# EAGLE board 17341^0 (EAGLE 7.6.0), part 1 of 2
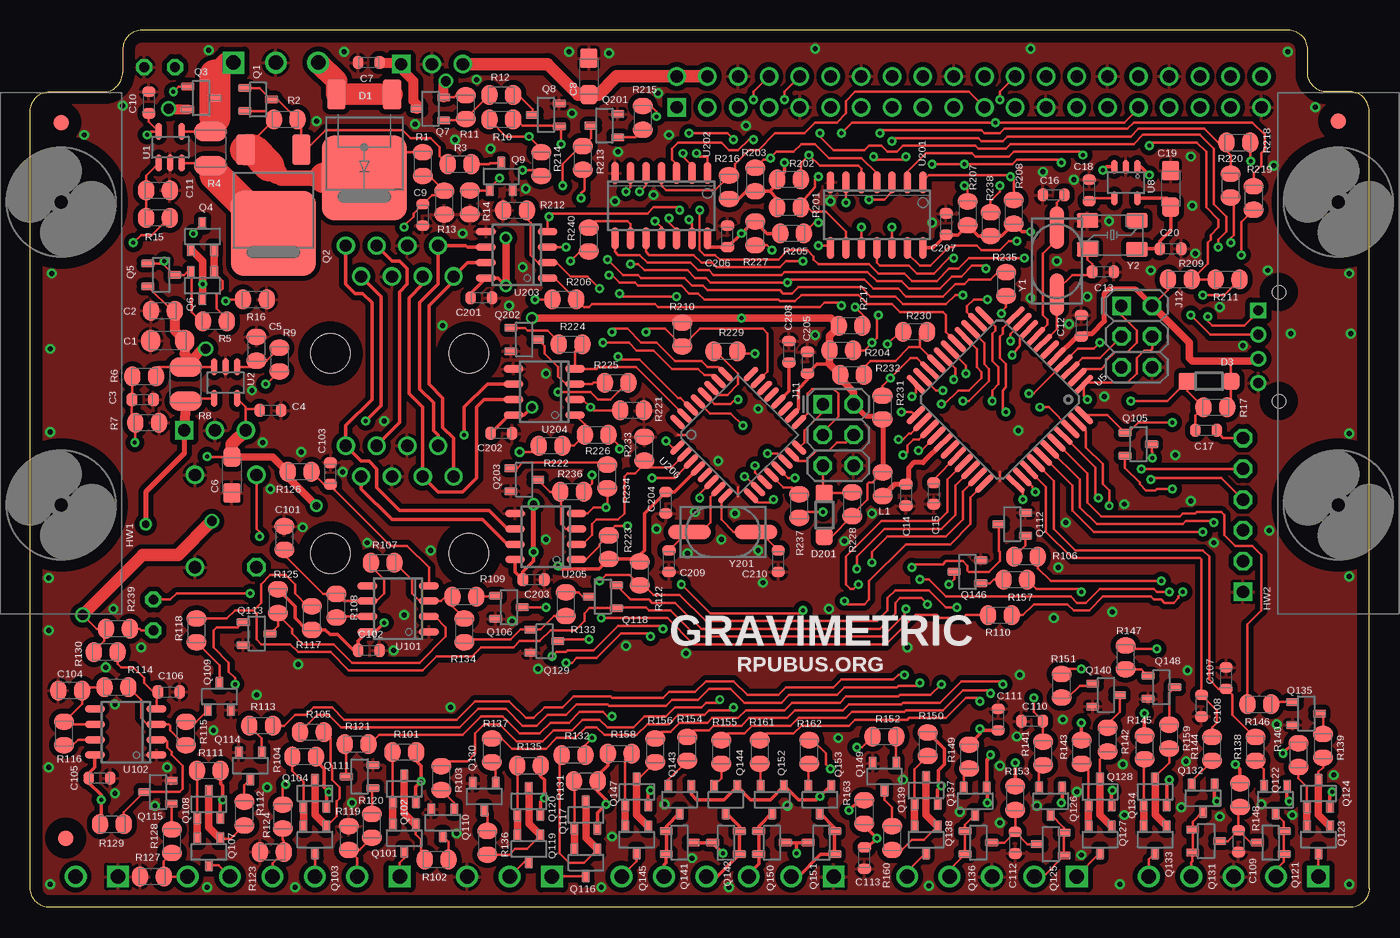
[diagram p3: board, top side]
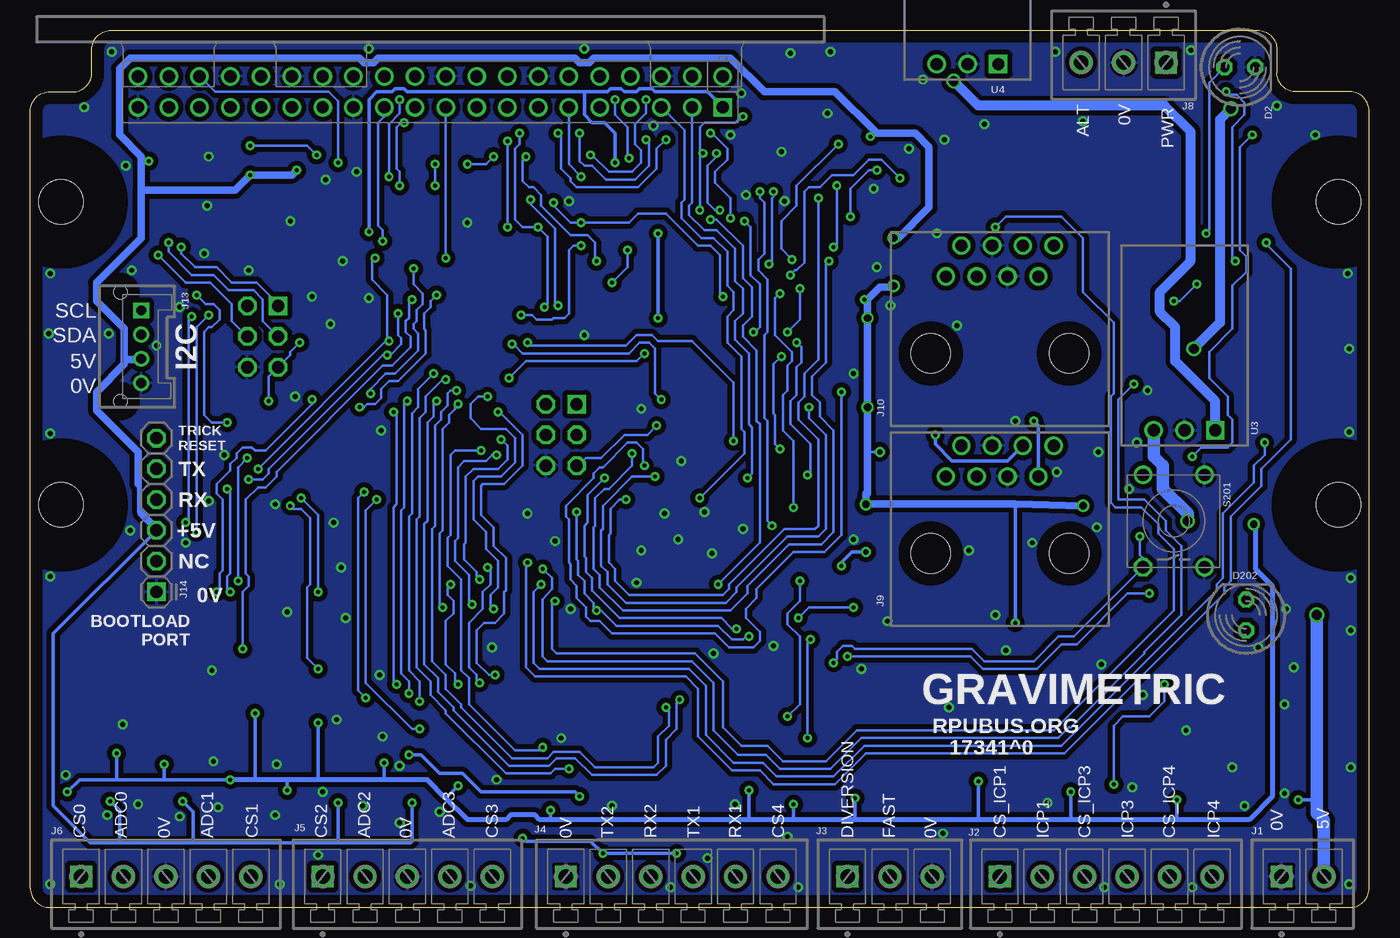
[diagram p4: board, bottom side, seen from below]

Size 110.49 x 72.39 mm. Coordinates in mm from the lower left corner, seen from the top.
Outline: 110.49,1.59 110.49,65.72 arc90 108.9,67.31 107,67.31 arc-90 105.41,68.9 105.41,70.8 arc90 103.82,72.39 9.21,72.39 arc90 7.62,70.8 7.62,68.9 arc-90 6.03,67.31 1.59,67.31 arc90 0,65.72 0,1.59 arc90 1.59,0 108.9,0 arc90 110.49,1.59
Copper layers (1*16): Top 0.034290625mm / dielectric 60mil / Bottom 0.034290625mm
Design rules "default *": minimum track width 7mil, minimum drill 13mil, track to track 12mil, track to pad 10mil, pad to pad 8mil, via to via 12mil, smd to smd 8mil, copper to edge 40mil, drill to drill 16mil, minimum pad ring 10mil, minimum via ring 8mil, stop-mask expansion 4mil, vias tented up to drill 17mil, thermal gap 10mil
Net classes: 0 default: width 0.178 mm, drill 0.33 mm

## Footprints (pad centres in the part's own frame; a part is rotated, then mirrored left to right if it is on the bottom)
C1206(3216) = smd 1.6 x 1.8: 1 -1.4,0; 2 1.4,0
C0805(2012) = smd 1.321 x 1.651: 1 -0.977,0; 2 0.977,0
C0603(1608) = smd 0.898 x 1.1: 1 -0.889,0; 2 0.889,0
3216 = smd 1.6 x 1.4: + -1.5,0; - 1.5,0
DPAK_A+A-K = smd 1.5 x 2.5: A1 -2.3,-6.9; A2 2.3,-6.9 | smd 7 x 7: K 0,0
LED5MM = drill 0.813 octagon: A -1.27,0; K 1.27,0
SOD123 = smd 1.4 x 1.4: A 1.8,0; C -1.8,0
USA10 = hole 3.658: -12.5,0; 12.5,0
MCV2 = drill 1.2 square: 1 0,0 | drill 1.2: 2 3.5,0
MCV6 = drill 1.2 square: 1 0,0 | drill 1.2: 2 3.5,0; 3 7,0; 4 10.5,0; 5 14,0; 6 17.5,0
MCV3 = drill 1.2 square: 1 0,0 | drill 1.2: 2 3.5,0; 3 7,0
MCV5 = drill 1.2 square: 1 0,0 | drill 1.2: 2 3.5,0; 3 7,0; 4 10.5,0; 5 14,0
RASPI_ZERO_V40PIN = drill 1.016 square: 1 0,2.54 | drill 1.016: 2 0,0; 3 2.54,2.54; 4 2.54,0; 5 5.08,2.54; 6 5.08,0; 7 7.62,2.54; 8 7.62,0; 9 10.16,2.54; 10 10.16,0; 11 12.7,2.54; 12 12.7,0; 13 15.24,2.54; 14 15.24,0; 15 17.78,2.54; 16 17.78,0; 17 20.32,2.54; 18 20.32,0; 19 22.86,2.54; 20 22.86,0; 21 25.4,2.54; 22 25.4,0; 23 27.94,2.54; 24 27.94,0; 25 30.48,2.54; 26 30.48,0; 27 33.02,2.54; 28 33.02,0; 29 35.56,2.54; 30 35.56,0; 31 38.1,2.54; 32 38.1,0; 33 40.64,2.54; 34 40.64,0; 35 43.18,2.54; 36 43.18,0; 37 45.72,2.54; 38 45.72,0; 39 48.26,2.54; 40 48.26,0
RJ45-8HZT = drill 1: 1 -4.445,6.35; 2 -3.175,8.89; 3 -1.905,6.35; 4 -0.635,8.89; 5 0.635,6.35; 6 1.905,8.89; 7 3.175,6.35; 8 4.445,8.89 | hole 3.264: -5.715,0; 5.715,0
ISP = drill 1.016 square: 1 0,0 | drill 1.016 octagon: 2 0,2.54; 3 2.54,0; 4 2.54,2.54; 5 5.08,0; 6 5.08,2.54
B04B = drill 0.8 square: 1 0,0 | drill 0.8: 2 2,0; 3 4,0; 4 6,0 | hole 1.1: 7.5,-1.7; -1.5,-1.7
FRIEND = drill 1.016 square: 1 0,0 | drill 1.016 octagon: 2 2.54,0; 3 5.08,0; 4 7.62,0; 5 10.16,0; 6 12.7,0
SOT23 = smd 0.65 x 1.06: B -0.95,-1.1; C 0,1.1; E 0.95,-1.1
DPAK = smd 1.5 x 2.5: 1 -2.3,-6.9; 3 2.3,-6.9 | smd 7 x 7: SINK 0,0
SOT23' = smd 0.65 x 1.06: 1(G) -0.95,-1.1; 2(S) 0.95,-1.1; 3(D) 0,1.1
C1210(3225) = smd 1.6 x 2.7: 1 -1.4,0; 2 1.4,0
0M311 = drill 1.016 octagon: 1 -3.81,2.54 | drill 1.016: 2 3.81,2.54; 3 -3.81,-2.54; 4 3.81,-2.54
SOT23-5 = smd 0.55 x 1.4: 1 -0.95,-1.3; 2 0,-1.3; 3 0.95,-1.3; 4 0.95,1.3; 5 -0.95,1.3
OKI-78SR-H = drill 1.016 square: 1 0,0 | drill 1.016: 2 -2.54,0; 3 -5.08,0
TQFP44 = smd 2 x 0.45: 1 -5.8,4; 2 -5.8,3.2; 3 -5.8,2.4; 4 -5.8,1.6; 5 -5.8,0.8; 6 -5.8,0; 7 -5.8,-0.8; 8 -5.8,-1.6; 9 -5.8,-2.4; 10 -5.8,-3.2; 11 -5.8,-4; 23 5.8,-4; 24 5.8,-3.2; 25 5.8,-2.4; 26 5.8,-1.6; 27 5.8,-0.8; 28 5.8,0; 29 5.8,0.8; 30 5.8,1.6; 31 5.8,2.4; 32 5.8,3.2; 33 5.8,4 | smd 0.45 x 2: 12 -4,-5.8; 13 -3.2,-5.8; 14 -2.4,-5.8; 15 -1.6,-5.8; 16 -0.8,-5.8; 17 0,-5.8; 18 0.8,-5.8; 19 1.6,-5.8; 20 2.4,-5.8; 21 3.2,-5.8; 22 4,-5.8; 34 4,5.8; 35 3.2,5.8; 36 2.4,5.8; 37 1.6,5.8; 38 0.8,5.8; 39 0,5.8; 40 -0.8,5.8; 41 -1.6,5.8; 42 -2.4,5.8; 43 -3.2,5.8; 44 -4,5.8
SOT23-5,SOT25 = smd 0.55 x 1.2: 1 -0.95,-1.3; 2 0,-1.3; 3 0.95,-1.3; 4 0.95,1.3; 5 -0.95,1.3
SOIC8 = smd 0.6 x 1.6: 1 -1.905,-2.54; 2 -0.635,-2.54; 3 0.635,-2.54; 4 1.905,-2.54; 5 1.905,2.54; 6 0.635,2.54; 7 -0.635,2.54; 8 -1.905,2.54
14SOIC = smd 0.6 x 1.8: 1 -3.81,-2.7; 2 -2.54,-2.7; 3 -1.27,-2.7; 4 0,-2.7; 5 1.27,-2.7; 6 2.54,-2.7; 7 3.81,-2.7; 8 3.81,2.7; 9 2.54,2.7; 10 1.27,2.7; 11 0,2.7; 12 -1.27,2.7; 13 -2.54,2.7; 14 -3.81,2.7
TQFP32-08 = smd 1.5 x 0.45: 1 -4.293,2.8; 2 -4.293,2; 3 -4.293,1.2; 4 -4.293,0.4; 5 -4.293,-0.4; 6 -4.293,-1.2; 7 -4.293,-2; 8 -4.293,-2.8; 17 4.293,-2.8; 18 4.293,-2; 19 4.293,-1.2; 20 4.293,-0.4; 21 4.293,0.4; 22 4.293,1.2; 23 4.293,2; 24 4.293,2.8 | smd 0.45 x 1.5: 9 -2.8,-4.293; 10 -2,-4.293; 11 -1.2,-4.293; 12 -0.4,-4.293; 13 0.4,-4.293; 14 1.2,-4.293; 15 2,-4.293; 16 2.8,-4.293; 25 2.8,4.293; 26 2,4.293; 27 1.2,4.293; 28 0.4,4.293; 29 -0.4,4.293; 30 -1.2,4.293; 31 -2,4.293; 32 -2.8,4.293
FIDUCIAL-1.27 = smd 1.27 x 1.27: 1 0,0
CSM-3X = smd 3.5 x 1.2: 1 -2.75,0; 2 2.75,0
CRYSTAL5X3.2MM = smd 1.778 x 1.194: 1 -2.032,-1.194; 2 2.032,-1.194; 3 2.032,1.194; 4 -2.032,1.194

## Placement (x,y rotation side)
C1  10uF  [C1206(3216)]  11.34,46.77 180 top
C2  .1uF  [C0805(2012)]  10.94,49.25 180 top
C3  .01uF  [C0603(1608)]  9.27,41.91 0 top
C4  .1uF  [C0603(1608)]  19.81,41.02 0 top
C5  1uF  [C0805(2012)]  18.67,46.1 90 top
C6  106A  [3216]  16.64,35.69 270 top
C7  .1uF  [C0603(1608)]  27.94,69.72 180 top
C8  10uF  [3216]  46.1,68.58 90 top
C9  .01uF  [C0603(1608)]  32.38,57.15 270 top
C10  .1uF  [C0603(1608)]  9.78,66.42 90 top
C11  1uF  [C0805(2012)]  10.54,59.18 0 top
C12  .1uF  [C0603(1608)]  86.74,48.01 90 top
C13  27pF  [C0603(1608)]  88.52,52.45 180 top
C14  .1uF  [C0603(1608)]  72.26,34.04 270 top
C15  .1uF  [C0603(1608)]  74.55,34.16 270 top
C16  27pF  [C0603(1608)]  84.45,58.8 0 top
C17  .1uF  [C0603(1608)]  97.03,39.37 0 top
C18  470pF  [C0603(1608)]  87.38,59.18 90 top
C19  10uF  [3216]  94.11,59.31 90 top
C20  .1uF  [C0603(1608)]  94.11,54.36 0 top
C101  .01uF  [C0805(2012)]  20.96,30.48 90 top
C102  100nF  [C0603(1608)]  27.94,21.21 0 top
C103  100nF  [C0603(1608)]  24.77,35.81 90 top
C104  0.01uF  [C0805(2012)]  3.3,17.91 180 top
C105  100nF  [C0603(1608)]  5.71,10.67 0 top
C106  100nF  [C0603(1608)]  11.43,17.78 0 top
C107  .01uF  [C0603(1608)]  98.68,18.92 90 top
C108  .01uF  [C0603(1608)]  96.65,16.64 270 top
C109  .1uF  [C0603(1608)]  99.7,5.46 270 top
C110  .01uF  [C0603(1608)]  82.68,15.37 180 top
C111  .01uF  [C0603(1608)]  79.88,15.49 90 top
C112  .1uF  [C0603(1608)]  81.28,5.33 270 top
C113  .1uF  [C0603(1608)]  68.83,4.06 270 top
C201  .1uF  [C0603(1608)]  37.21,50.29 0 top
C202  .1uF  [C0603(1608)]  38.86,39.12 0 top
C203  .1uF  [C0603(1608)]  41.53,27.05 0 top
C204  .1uF  [C0603(1608)]  52.45,33.4 270 top
C205  .1uF  [C0603(1608)]  64.14,44.96 90 top
C206  .1uF  [C0603(1608)]  57.53,55.37 90 top
C207  .1uF  [C0603(1608)]  75.56,56.39 90 top
C208  .1uF  [C0603(1608)]  62.61,45.85 90 top
C209  27pF  [C0603(1608)]  52.7,28.57 270 top
C210  27pF  [C0603(1608)]  61.72,28.57 270 top
D1  MBRD1045  [DPAK_A+A-K]  27.56,60.2 180 top
D2  5MMGN  [LED5MM]  10.67,69.34 0 bottom
D3  T4  [SOD123]  97.28,43.43 180 top
D201  T4  [SOD123]  65.53,32.38 90 top
D202  5MMRD  [LED5MM]  10.16,24.13 90 bottom
HW1  USA10-4,6  [USA10]  2.54,45.72 90 top
HW2  USA10-4,6  [USA10]  107.95,45.72 90 top
J1  PST1,0/2-3,5  [MCV2]  7.24,2.54 0 bottom
J2  PST1,0/6-3,5  [MCV6]  30.48,2.54 0 bottom
J3  PST1,0/3-3,5  [MCV3]  43.05,2.54 0 bottom
J4  [MCV6]  66.29,2.54 0 bottom
J5  PST1,0/5-3,5  [MCV5]  86.36,2.54 0 bottom
J6  PST1,0/5-3,5  [MCV5]  106.3,2.54 0 bottom
J7  Pi Zero  [RASPI_ZERO_V40PIN]  53.34,68.58 180 bottom
J8  PST1,0/3-3,5  [MCV3]  16.76,69.72 180 bottom
J9  RJ45J  [RJ45-8HZT]  30.48,29.21 0 bottom
J10  RJ45J  [RJ45-8HZT]  30.48,45.72 0 bottom
J11  [ISP]  65.41,41.53 270 top
J12  ICSP  [ISP]  90.04,49.66 270 top
J13  S04B  [B04B]  101.35,49.28 270 bottom
J14  FRIEND  [FRIEND]  100.08,26.04 90 bottom
L1  JMP  [C0805(2012)]  70.36,34.92 270 top
Q1  K1N  [SOT23]  18.8,66.67 270 top
Q2  IRFR5305  [DPAK]  20.07,55.63 180 top
Q3  P65  [SOT23']  14.1,66.8 270 top
Q4  K3N  [SOT23]  14.22,55.37 0 top
Q5  K1N  [SOT23]  10.79,52.2 270 top
Q6  K3N  [SOT23]  14.22,51.31 180 top
Q7  P65  [SOT23']  33.02,65.91 90 top
Q8  K38  [SOT23']  42.54,65.41 90 top
Q9  K38  [SOT23']  38.86,60.33 0 top
Q101  K3N  [SOT23]  30.86,5.71 180 top
Q102  K3N  [SOT23]  30.86,9.78 0 top
Q103  K3N  [SOT23]  23.5,5.59 180 top
Q104  K3N  [SOT23]  23.5,9.4 0 top
Q105  K38  [SOT23']  91.44,38.23 270 top
Q106  K1N  [SOT23]  39.5,24.77 270 top
Q107  K3N  [SOT23]  14.73,4.57 180 top
Q108  K3N  [SOT23]  14.73,8.51 0 top
Q109  K1N  [SOT23]  15.62,17.4 0 top
Q110  K1N  [SOT23]  34.04,6.99 180 top
Q111  K1N  [SOT23]  27.18,10.79 90 top
Q112  K1N  [SOT23]  81.03,31.62 90 top
Q113  K1N  [SOT23]  18.67,22.61 270 top
Q114  K1N  [SOT23]  18.16,11.68 180 top
Q115  K1N  [SOT23]  10.54,9.53 90 top
Q116  K3N  [SOT23]  45.85,3.68 180 top
Q117  K3N  [SOT23]  45.85,7.62 0 top
Q118  K38  [SOT23']  47.24,25.65 90 top
Q119  K3N  [SOT23]  41.15,4.83 180 top
Q120  K3N  [SOT23]  41.15,8.76 0 top
Q121  K1N  [SOT23]  102.36,5.33 90 top
Q122  K38  [SOT23']  102.74,8.89 180 top
Q123  K3N  [SOT23]  106.3,5.59 180 top
Q124  K3N  [SOT23]  106.3,9.4 0 top
Q125  K1N  [SOT23]  84.2,5.21 90 top
Q126  K38  [SOT23']  84.2,8.76 180 top
Q127  K3N  [SOT23]  88.27,5.59 180 top
Q128  K3N  [SOT23]  88.27,9.53 0 top
Q129  K1N  [SOT23]  42.42,21.97 270 top
Q130  K1N  [SOT23]  37.46,9.14 180 top
Q131  K1N  [SOT23]  97.03,5.46 270 top
Q132  K38  [SOT23']  96.77,9.02 180 top
Q133  K3N  [SOT23]  92.84,5.59 180 top
Q134  K3N  [SOT23]  92.84,9.53 0 top
Q135  K1N  [SOT23]  105.28,16 270 top
Q136  K1N  [SOT23]  78.23,5.33 270 top
Q137  K38  [SOT23']  77.98,8.76 180 top
Q138  K3N  [SOT23]  73.91,5.59 180 top
Q139  K3N  [SOT23]  73.91,9.65 0 top
Q140  K1N  [SOT23]  88.77,17.53 270 top
Q141  K1N  [SOT23]  53.59,5.33 270 top
Q142  K1N  [SOT23]  57.4,5.33 90 top
Q143  K38  [SOT23']  53.59,8.89 180 top
Q144  K38  [SOT23']  57.4,8.89 180 top
Q145  K3N  [SOT23]  50.04,5.59 180 top
Q146  K1N  [SOT23]  77.34,27.69 90 top
Q147  K3N  [SOT23]  50.04,9.53 0 top
Q148  K1N  [SOT23]  93.34,18.16 270 top
Q149  K1N  [SOT23]  70.48,10.79 180 top
Q150  K1N  [SOT23]  61.21,5.33 270 top
Q151  K1N  [SOT23]  65.28,5.33 90 top
Q152  K38  [SOT23']  61.21,8.89 180 top
Q153  K38  [SOT23']  65.15,8.89 180 top
Q201  K1N  [SOT23]  47.37,64.52 90 top
Q202  K1N  [SOT23]  40.77,46.86 270 top
Q203  K1N  [SOT23]  40.77,35.31 270 top
R1  100k  [C0805(2012)]  32.38,61.34 90 top
R2  100k  [C0805(2012)]  21.08,65.02 180 top
R3  49.9k  [C0805(2012)]  35.43,61.34 180 top
R4  0.018  [C1210(3225)]  14.86,62.61 270 top
R5  1K  [C0805(2012)]  15.24,48.39 180 top
R6  100k  [C0805(2012)]  9.4,43.81 0 top
R7  15.8k  [C0805(2012)]  9.65,40.01 180 top
R8  0.068  [C1210(3225)]  12.83,43.18 90 top
R9  10k  [C0805(2012)]  20.57,45.21 90 top
R10  10k  [C0805(2012)]  38.86,65.02 180 top
R11  100k  [C0805(2012)]  35.94,66.04 270 top
R12  80.6k  [C0805(2012)]  38.86,67.06 0 top
R13  10k  [C0805(2012)]  34.16,58.17 90 top
R14  10k  [C0805(2012)]  36.28,58.18 270 top
R15  10k  [C0805(2012)]  10.54,56.9 180 top
R16  100k  [C0805(2012)]  18.54,50.16 180 top
R17  10K  [C0805(2012)]  97.79,41.27 0 top
R101  32.4  [C0805(2012)]  30.86,12.83 0 top
R102  49.9k  [C0805(2012)]  33.53,3.94 180 top
R103  10k  [C0805(2012)]  33.91,10.67 270 top
R104  32.4  [C0805(2012)]  22.61,12.45 0 top
R105  49.9k  [C0805(2012)]  23.24,14.48 0 top
R106  10k  [C0805(2012)]  82.17,28.96 180 top
R107  100k  [C0805(2012)]  29.08,28.45 0 top
R108  182  [C0805(2012)]  25.27,24.89 270 top
R109  10k  [C0805(2012)]  35.81,25.65 0 top
R110  182  [C0805(2012)]  80.01,24.13 180 top
R111  32.4  [C0805(2012)]  14.73,11.3 0 top
R112  49.9k  [C0805(2012)]  17.65,7.75 270 top
R113  10k  [C0805(2012)]  19.05,14.99 180 top
R114  100k  [C0805(2012)]  7.11,18.16 0 top
R115  10k  [C0805(2012)]  12.83,14.35 90 top
R116  182  [C0805(2012)]  2.79,14.35 270 top
R117  10k  [C0805(2012)]  23.24,23.88 90 top
R118  182  [C0805(2012)]  13.72,22.86 90 top
R119  100  [C0805(2012)]  26.29,5.71 270 top
R120  10k  [C0805(2012)]  28.19,6.73 90 top
R121  182  [C0805(2012)]  26.92,13.46 0 top
R122  10k  [C0805(2012)]  50.29,27.56 270 top
R123  100  [C0805(2012)]  19.94,4.57 0 top
R124  10k  [C0805(2012)]  20.83,7.49 90 top
R125  10k  [C0805(2012)]  20.45,25.27 270 top
R126  100k  [C0805(2012)]  22.23,35.94 180 top
R127  100  [C0805(2012)]  10.03,2.54 0 top
R128  10k  [C0805(2012)]  11.68,5.46 90 top
R129  10k  [C0805(2012)]  6.73,6.86 0 top
R130  100k  [C0805(2012)]  6.22,21.08 180 top
R131  27  [C0805(2012)]  45.85,10.41 0 top
R132  49.9k  [C0805(2012)]  44.83,12.57 180 top
R133  10k  [C0805(2012)]  44.2,25.02 270 top
R134  10k  [C0805(2012)]  35.81,22.86 270 top
R135  27  [C0805(2012)]  41.15,11.68 0 top
R136  49.9k  [C0805(2012)]  37.72,5.33 270 top
R137  10k  [C0805(2012)]  38.1,12.95 270 top
R138  127  [C0805(2012)]  101.09,13.08 90 top
R139  49.9k  [C0805(2012)]  106.68,13.34 270 top
R140  27  [C0805(2012)]  104.65,12.57 90 top
R141  127  [C0805(2012)]  83.57,12.7 90 top
R142  49.9k  [C0805(2012)]  88.9,13.84 270 top
R143  27  [C0805(2012)]  86.74,12.83 90 top
R144  127  [C0805(2012)]  97.54,13.08 90 top
R145  27  [C0805(2012)]  91.95,13.21 90 top
R146  10k  [C0805(2012)]  101.41,16.76 180 top
R147  10k  [C0805(2012)]  90.39,20.63 90 top
R148  100K  [C0805(2012)]  99.82,9.27 270 top
R149  127  [C0805(2012)]  77.47,12.45 90 top
R150  27  [C0805(2012)]  74.04,13.46 90 top
R151  10k  [C0805(2012)]  85.09,18.29 90 top
R152  10k  [C0805(2012)]  70.48,14.1 180 top
R153  100K  [C0805(2012)]  81.28,9.02 270 top
R154  127  [C0805(2012)]  54.23,13.08 90 top
R155  127  [C0805(2012)]  57.02,12.83 90 top
R156  49.9k  [C0805(2012)]  51.56,12.95 270 top
R157  10k  [C0805(2012)]  81.28,27.05 0 top
R158  27  [C0805(2012)]  48.64,12.7 180 top
R159  49.9k  [C0805(2012)]  93.98,14.1 270 top
R160  49.9k  [C0805(2012)]  71.12,5.71 270 top
R161  127  [C0805(2012)]  60.2,12.83 90 top
R162  127  [C0805(2012)]  64.26,12.83 90 top
R163  100K  [C0805(2012)]  68.83,7.87 270 top
R201  10k  [C0805(2012)]  62.61,57.78 0 top
R202  10k  [C0805(2012)]  62.61,60.07 0 top
R203  1.82k  [C0805(2012)]  59.82,60.07 270 top
R204  3.01k  [C0805(2012)]  66.93,45.97 180 top
R205  3.01k  [C0805(2012)]  62.87,55.63 180 top
R206  10k  [C0805(2012)]  44.07,50.16 180 top
R207  10k  [C0805(2012)]  77.34,57.28 270 top
R208  10k  [C0805(2012)]  81.15,57.4 270 top
R209  3.01k  [C0805(2012)]  94.87,51.82 0 top
R210  10k  [C0805(2012)]  53.81,47.28 90 top
R211  182  [C0805(2012)]  98.81,51.82 180 top
R212  3.01k  [C0805(2012)]  40,57.53 0 top
R213  3.01k  [C0805(2012)]  45.59,61.85 270 top
R214  10K  [C0805(2012)]  42.16,61.34 270 top
R215  100k  [C0805(2012)]  50.55,65.15 90 top
R216  1.82k  [C0805(2012)]  57.66,59.44 90 top
R217  3.01k  [C0805(2012)]  67.69,48.01 0 top
R218  3.01k  [C0805(2012)]  99.7,63.12 180 top
R219  182  [C0805(2012)]  100.97,58.55 90 top
R220  182  [C0805(2012)]  99.06,59.56 90 top
R221  3.01k  [C0805(2012)]  49.66,41.02 180 top
R222  10k  [C0805(2012)]  42.93,38.1 180 top
R223  10k  [C0805(2012)]  47.75,29.72 270 top
R224  100k  [C0805(2012)]  44.58,46.48 0 top
R225  3.01k  [C0805(2012)]  48.39,43.31 0 top
R226  1.82k  [C0805(2012)]  46.74,38.99 0 top
R227  10K  [C0805(2012)]  59.82,55.63 270 top
R228  10K  [C0805(2012)]  67.82,33.27 270 top
R229  182  [C0805(2012)]  57.37,45.88 180 top
R230  182  [C0805(2012)]  73.03,47.5 180 top
R231  3.01k  [C0805(2012)]  70.32,41.26 270 top
R232  3.01k  [C0805(2012)]  67.82,43.94 180 top
R233  3.01k  [C0805(2012)]  50.67,37.85 90 top
R234  100k  [C0805(2012)]  47.62,35.56 90 top
R235  182  [C0805(2012)]  80.52,51.44 90 top
R236  3.01k  [C0805(2012)]  44.7,34.29 180 top
R237  1.82k  [C0805(2012)]  63.45,33.12 90 top
R238  10K  [C0805(2012)]  79.25,56.39 270 top
R239  1.82k  [C0805(2012)]  7.24,22.99 0 top
R240  10k  [C0805(2012)]  46.1,55.12 90 top
S201  KSA0M311  [0M311]  16.13,31.88 90 bottom
U1  1087  [SOT23-5]  11.56,62.74 0 top
U2  1087  [SOT23-5]  16.13,43.31 180 top
U3  I50115  [OKI-78SR-H]  12.7,39.37 0 bottom
U4  I50115  [OKI-78SR-H]  30.61,69.6 0 bottom
U5  ATMEGA324PB-AU  [TQFP44]  80.01,41.91 225 top
U8  KB33  [SOT23-5,SOT25]  90.42,59.82 180 top
U101  ICM7555  [SOIC8]  30.35,24.64 90 top
U102  ICM7555  [SOIC8]  7.87,14.48 90 top
U201  74LVC07A  [14SOIC]  69.85,57.15 180 top
U202  74LVC07A  [14SOIC]  52.07,57.91 180 top
U203  THVD1500  [SOIC8]  40.13,53.85 90 top
U204  THVD1500  [SOIC8]  42.42,42.55 90 top
U205  THVD1500  [SOIC8]  42.54,30.61 90 top
U206  ATMEGA328PB-AU  [TQFP32-08]  58.42,38.99 45 top
U$1  R-PI3B+  [R-PI3B+]  77.47,67.31 0 bottom
U$2  FIDUCIAL1.27  [FIDUCIAL-1.27]  107.95,64.9 0 top
U$3  FIDUCIAL1.27  [FIDUCIAL-1.27]  2.54,64.77 0 top
U$4  FIDUCIAL1.27  [FIDUCIAL-1.27]  2.92,5.71 0 top
Y1  16MHz  [CSM-3X]  84.71,53.34 90 top
Y2  FT5HNBPK16  [CRYSTAL5X3.2MM]  89.28,55.5 180 top
Y201  12MHz  [CSM-3X]  57.15,30.99 0 top